# EAGLE design usblcd (EAGLE 6.6.0)
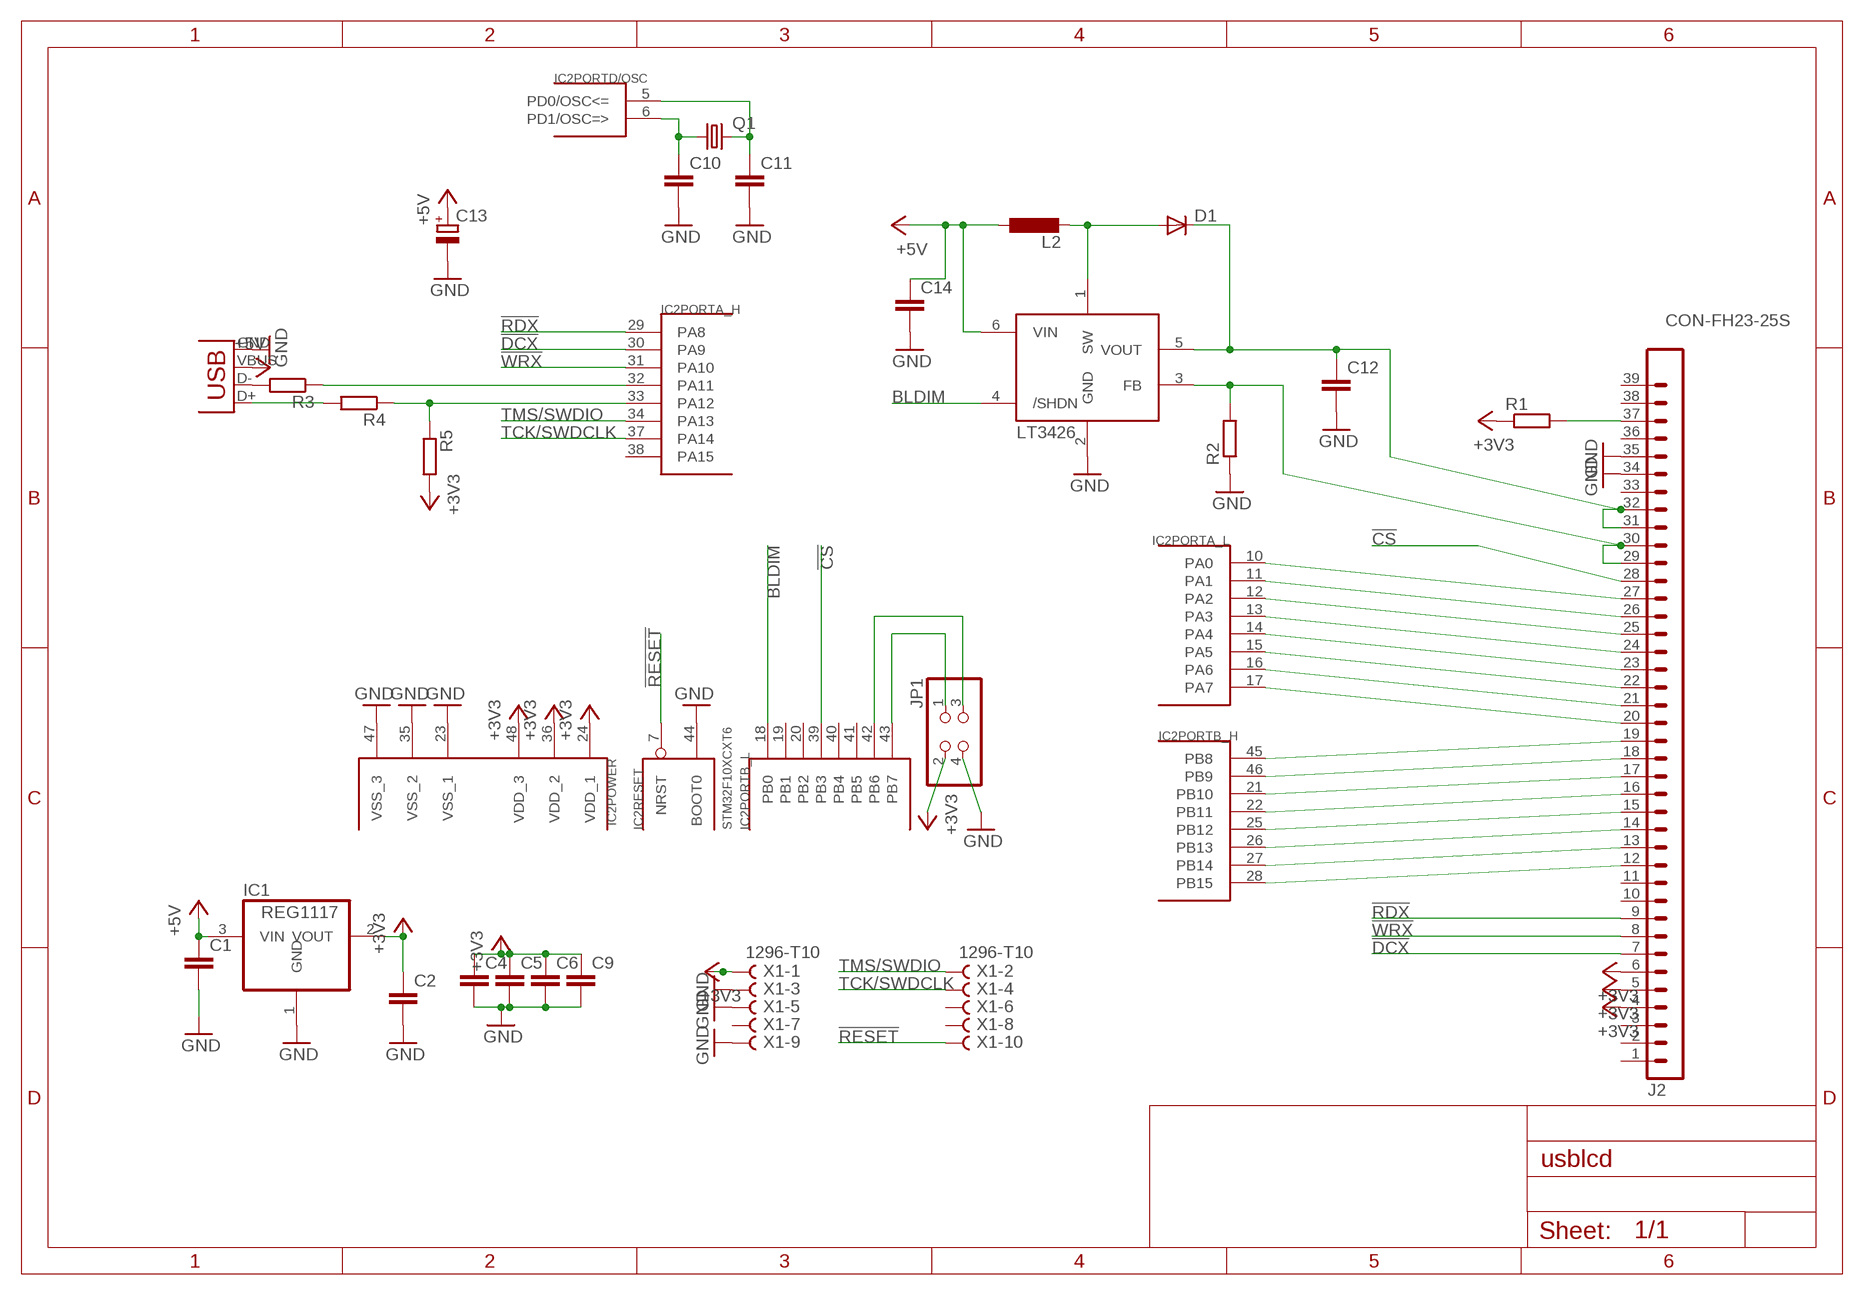
[diagram p0: schematic, sheet 1]

## Parts
C1  C-EUC0603  [C0603]
C2  C-EUC0603  [C0603]
C4  C-EUC0603  [C0603]
C5  C-EUC0805  [C0805]
C6  C-EUC0603  [C0603]
C9  C-EUC0603  [C0603]
C10  C-EUC0603  [C0603]
C11  C-EUC0603  [C0603]
C12  C-EUC0805  [C0805]
C13  CPOL-EUC  [PANASONIC_C]
C14  C-EUC0603  [C0603]
D1  DIODE-SOD323-W  [SOD323-W]
IC1  REG1117  [SOT223]
IC2  STM32F10XCXT6  [TQFP48]
J2  CON-FH23-25S  [FH23-25S]
JP1  PINHD-2X2_2.54-SMD  [2X02SMD]
L2  L-EUL3230M  [L3230M]
Q1  CRYSTALCTS406  [CTS406]
R1  R-EU_R0603  [R0603]
R2  R-EU_R0603  [R0603]
R3  R-EU_R0603  [R0603]
R4  R-EU_R0603  [R0603]
R5  R-EU_R0603  [R0603]
U$4  LT3426  [SOT23-6]
X1  1296-T10  [1296-10]
X2  USB-MICROB  [USB-MICROB]

## Nets
!CS: IC2.39(PORTB_L:PB3) J2.28
!DCX: IC2.30(PORTA_H:PA9) J2.7
!RDX: IC2.29(PORTA_H:PA8) J2.9
!RESET: IC2.7(RESET:NRST) X1.10
!WRX: IC2.31(PORTA_H:PA10) J2.8
+3V3: C2.1 C4.1 C5.1 C6.1 C9.1 IC1.2(VOUT) IC2.24(POWER:VDD_1) IC2.36(POWER:VDD_2) IC2.48(POWER:VDD_3) J2.4 J2.5 J2.6 JP1.2 R1.1 R5.2 X1.1
+5V: C1.1 C13.+ C14.1 IC1.3(VIN) L2.1 U$4.6(VIN) X2.VBUS
BLDIM: IC2.18(PORTB_L:PB0) U$4.4(/SHDN)
GND: C1.2 C2.2 C4.2 C5.2 C6.2 C9.2 C10.2 C11.2 C12.2 C13.- C14.2 IC1.1(GND) IC2.23(POWER:VSS_1) IC2.35(POWER:VSS_2) IC2.44(RESET:BOOT0) IC2.47(POWER:VSS_3) J2.34 J2.35 JP1.4 R2.1 U$4.2(GND) X1.3 X1.5 X1.9 X2.GND
N$1: IC2.16(PORTA_L:PA6) J2.21
N$2: IC2.15(PORTA_L:PA5) J2.22
N$3: IC2.14(PORTA_L:PA4) J2.23
N$4: IC2.13(PORTA_L:PA3) J2.24
N$5: IC2.12(PORTA_L:PA2) J2.25
N$6: IC2.11(PORTA_L:PA1) J2.26
N$7: IC2.10(PORTA_L:PA0) J2.27
N$8: IC2.32(PORTA_H:PA11) R3.1
N$9: IC2.27(PORTB_H:PB14) J2.13
N$10: IC2.26(PORTB_H:PB13) J2.14
N$11: IC2.25(PORTB_H:PB12) J2.15
N$12: IC2.22(PORTB_H:PB11) J2.16
N$13: IC2.21(PORTB_H:PB10) J2.17
N$14: IC2.46(PORTB_H:PB9) J2.18
N$15: IC2.45(PORTB_H:PB8) J2.19
N$16: IC2.17(PORTA_L:PA7) J2.20
N$17: IC2.28(PORTB_H:PB15) J2.12
N$18: C10.1 IC2.6(PORTD/OSC:PD1/OSC=>) Q1.1
N$19: C11.1 IC2.5(PORTD/OSC:PD0/OSC<=) Q1.3
N$21: R3.2 X2.D-
N$22: R4.2 X2.D+
N$23: IC2.33(PORTA_H:PA12) R4.1 R5.1
N$31: D1.A L2.2 U$4.1(SW)
N$32: C12.1 D1.C J2.31 J2.32 U$4.5(VOUT)
N$33: J2.29 J2.30 R2.2 U$4.3(FB)
N$41: J2.37 R1.2
SCL: IC2.42(PORTB_L:PB6) JP1.3
SDA: IC2.43(PORTB_L:PB7) JP1.1
TCK/SWDCLK: IC2.37(PORTA_H:PA14) X1.4
TMS/SWDIO: IC2.34(PORTA_H:PA13) X1.2
Unconnected: IC2.2(PORTC:PC13) IC2.3(PORTC:PC14) IC2.4(PORTC:PC15) IC2.19(PORTB_L:PB1) IC2.20(PORTB_L:PB2) IC2.38(PORTA_H:PA15) IC2.40(PORTB_L:PB4) IC2.41(PORTB_L:PB5) J2.1 J2.2 J2.3 J2.10 J2.11 J2.33 J2.36 J2.38 J2.39 X1.6 X1.7 X1.8

## Power pins joined to a net without a drawn wire
VBAT: IC2.1(AN_POWER:VBAT)
VDDA: IC2.9(AN_POWER:VDDA)
VSSA: IC2.8(AN_POWER:VSSA)

## Library data of the parts
C1 C2 C4-C6 C9-C12 C14 = rcl:C-EU: CAPACITOR, European symbol
C13 = rcl:CPOL-EU: POLARIZED CAPACITOR, European symbol
D1 = diode:DIODE-: DIODE
IC1 = burr-brown:REG1117: 800mA and 1A Low Dropout (LDO) Positive Regulator 1.8V, 2.5V, 2.85V, 3.3V, 5V, and Adj; MPN: REG1117; OC_FARNELL: 1097566; OC_NEWARK: 14P6981
IC2 = stm32:STM32F10XCXT6: ST STM32F101/103 48pin LQFP
J2 = dummylcd:CON-FH23-25S
JP1 = pinhead:PINHD-2X2: PIN HEADER
L2 = rcl:L-EU: INDUCTOR, European symbol
Q1 = crystal:CRYSTAL: CRYSTAL; OC_FARNELL: unknown; OC_NEWARK: unknown
R1-R5 = rcl:R-EU_: RESISTOR, European symbol
U$4 = adafruit:LT3426: LT3426 1.2MHz, 2A boost converter in SOT-23 http://www.linear.com/pc/productDetail.jsp?navId=H0,C1,C1003,C1042,C1031,C1061,P8430 (Linear website)
X1 = con-leotronics:1296-T10: 1.27mm SINGLE ROW FEMALE SOCKET Source: http://www.leotronics.co.uk/Conexcon/Data%20Sheets/sec.%20A/1296ing.pdf; OC_FARNELL: unknown; OC_NEWARK: unknown
X2 = _Sparkfun:USB: USB Connectors USB-B-PTH is fully proven SKU : PRT-00139 USB-miniB is fully proven SKU : PRT-00587 USB-A-PCB is untested. USB-A-H is throughly reviewed, but untested. Spark Fun Electronics SKU : PRT-00437 USB-B-SMT is throughly reviewed, but untested. Needs silkscreen touching up. USB-A-S has not been used/tested USB-MB-H has not been used/tested

## Board
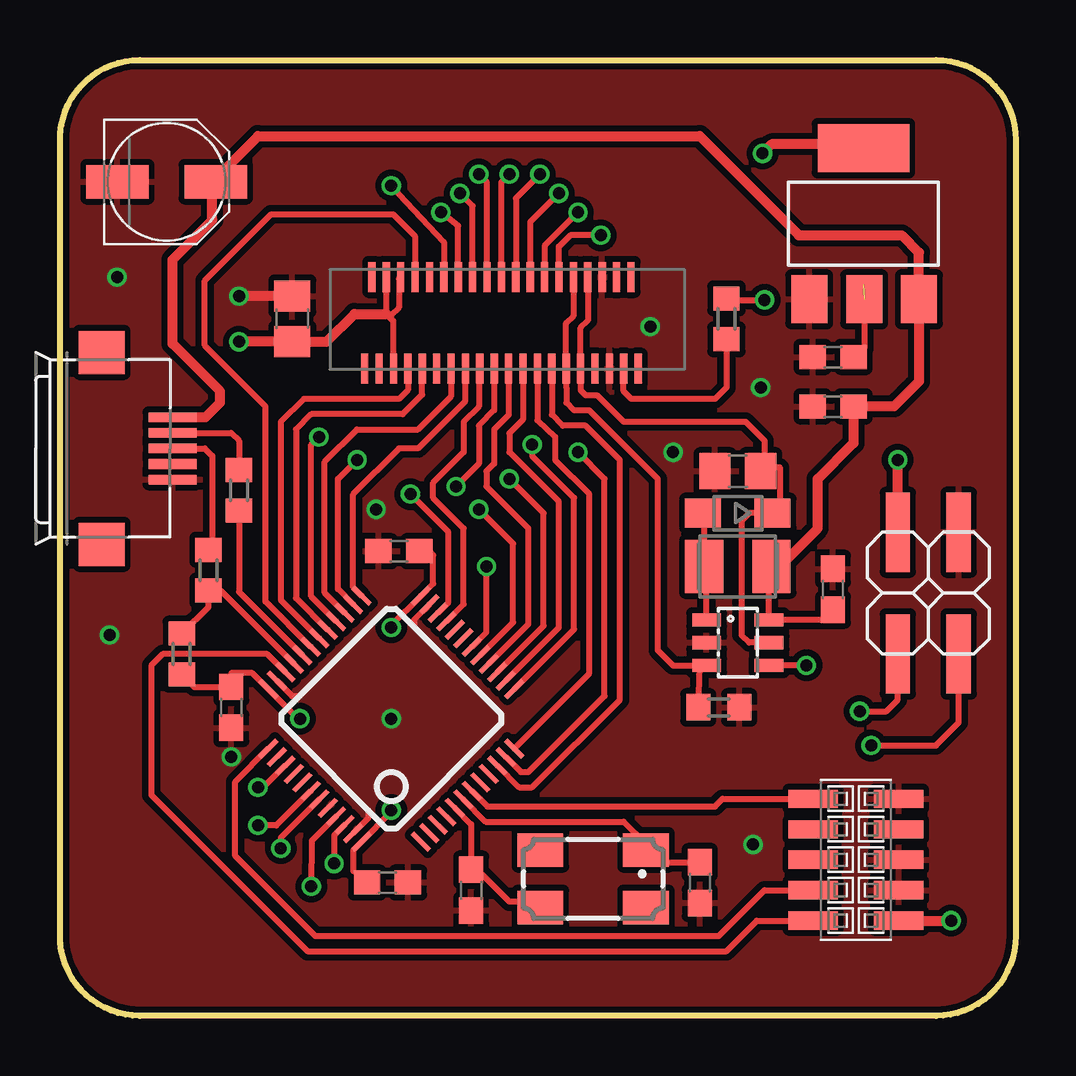
[diagram p1: board, top side]
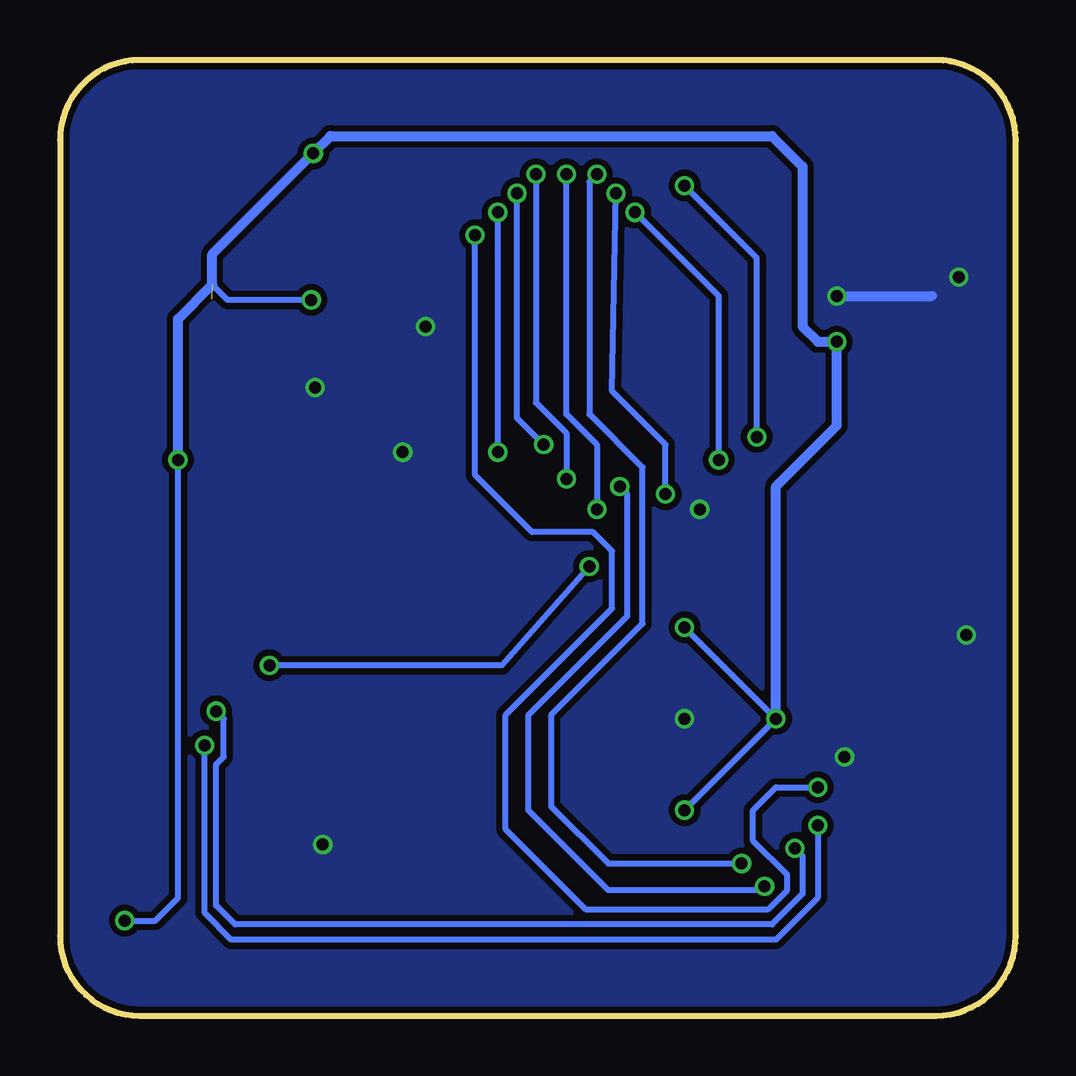
[diagram p2: board, bottom side, seen from below]

Size 39.85 x 39.85 mm. Coordinates in mm from the lower left corner, seen from the top.
Outline: 0,3.33 0,36.51 arc-90 3.33,39.85 36.51,39.85 arc-90 39.85,36.51 39.85,3.33 arc-90 36.51,0 3.33,0 arc-90 0,3.33
Copper layers (1*16): Top 0.035mm / dielectric 1.5mm / Bottom 0.035mm
Design rules "dirt_cheap_dirty_boards.v1": minimum track width 5mil, minimum drill 12mil, track to track 5mil, track to pad 5mil, pad to pad 5mil, via to via 5mil, smd to smd 0mil, copper to edge 10mil, drill to drill 10mil, minimum pad ring 10mil, minimum via ring 6mil, stop-mask expansion 2mil, vias tented up to drill 25mil, thermal gap 10mil

### Footprints (pad centres in the part's own frame; a part is rotated, then mirrored left to right if it is on the bottom)
C0603 = smd 1.1 x 1: 1 -0.85,0; 2 0.85,0
C0805 = smd 1.3 x 1.5: 1 -0.95,0; 2 0.95,0
PANASONIC_C = smd 2.6 x 1.4: + 2.05,0; - -2.05,0
SOD323-W = smd 1.5 x 1.2: A 1.45,0; C -1.45,0
SOT223 = smd 1.499 x 2.007: 1 -2.261,-3.15; 2 0.025,-3.15; 3 2.311,-3.15 | smd 3.81 x 2.007: 4 0,3.15
TQFP48 = smd 0.2 x 1: 1 -2.75,-4.5; 2 -2.25,-4.5; 3 -1.75,-4.5; 4 -1.25,-4.5; 5 -0.75,-4.5; 6 -0.25,-4.5; 7 0.25,-4.5; 8 0.75,-4.5; 9 1.25,-4.5; 10 1.75,-4.5; 11 2.25,-4.5; 12 2.75,-4.5; 25 2.75,4.5; 26 2.25,4.5; 27 1.75,4.5; 28 1.25,4.5; 29 0.75,4.5; 30 0.25,4.5; 31 -0.25,4.5; 32 -0.75,4.5; 33 -1.25,4.5; 34 -1.75,4.5; 35 -2.25,4.5; 36 -2.75,4.5 | smd 1 x 0.2: 13 4.5,-2.75; 14 4.5,-2.25; 15 4.5,-1.75; 16 4.5,-1.25; 17 4.5,-0.75; 18 4.5,-0.25; 19 4.5,0.25; 20 4.5,0.75; 21 4.5,1.25; 22 4.5,1.75; 23 4.5,2.25; 24 4.5,2.75; 37 -4.5,2.75; 38 -4.5,2.25; 39 -4.5,1.75; 40 -4.5,1.25; 41 -4.5,0.75; 42 -4.5,0.25; 43 -4.5,-0.25; 44 -4.5,-0.75; 45 -4.5,-1.25; 46 -4.5,-1.75; 47 -4.5,-2.25; 48 -4.5,-2.75
FH23-25S = smd 0.3 x 1.25: 1 0,0.625; 2 0.3,4.45; 3 0.6,0.625; 4 0.9,4.45; 5 1.2,0.625; 6 1.5,4.45; 7 1.8,0.625; 8 2.1,4.45; 9 2.4,0.625; 10 2.7,4.45; 11 3,0.625; 12 3.3,4.45; 13 3.6,0.625; 14 3.9,4.45; 15 4.2,0.625; 16 4.5,4.45; 17 4.8,0.625; 18 5.1,4.45; 19 5.4,0.625; 20 5.7,4.45; 21 6,0.625; 22 6.3,4.45; 23 6.6,0.625; 24 6.9,4.45; 25 7.2,0.625; 26 7.5,4.45; 27 7.8,0.625; 28 8.1,4.45; 29 8.4,0.625; 30 8.7,4.45; 31 9,0.625; 32 9.3,4.45; 33 9.6,0.625; 34 9.9,4.45; 35 10.2,0.625; 36 10.5,4.45; 37 10.8,0.625; 38 11.1,4.45; 39 11.4,0.625
2X02SMD = smd 1.016 x 3.302: 1 -1.27,-3.81; 2 -1.27,1.27; 3 1.27,-3.81; 4 1.27,1.27
L3230M = smd 1.6 x 2.2: 1 -1.4,0; 2 1.4,0
CTS406 = smd 1.9 x 1.4: 1 -2.2,-1.2; 2 2.2,-1.2; 3 2.2,1.2; 4 -2.2,1.2
R0603 = smd 1 x 1.1: 1 -0.85,0; 2 0.85,0
SOT23-6 = smd 0.55 x 1.2: 1 -0.95,-1.3; 2 0,-1.3; 3 0.95,-1.3; 4 0.95,1.3; 5 0,1.3; 6 -0.95,1.3
1296-10 = smd 0.76 x 2.05: 1 -2.54,-1.78; 2 -2.54,1.78; 3 -1.27,-1.78; 4 -1.27,1.78; 5 0,-1.78; 6 0,1.78; 7 1.27,-1.78; 8 1.27,1.78; 9 2.54,-1.78; 10 2.54,1.78
USB-MICROB = smd 0.4 x 2: D+ 0,3.1; D- -0.65,3.1; GND 1.3,3.1; ID 0.65,3.1; VBUS -1.3,3.1 | smd 1.8 x 1.9: GND@2 -4,0.15; GND@3 4,0.15

### Placement (x,y rotation side)
C1  32.23,25.4 180 top
C2  32.23,27.46 180 top
C4  7.14,12.86 270 top
C5  9.68,29.05 90 top
C6  13.65,5.56 0 top
C9  14.13,19.37 180 top
C10  26.67,5.56 270 top
C11  17.14,5.24 270 top
C12  28.26,22.7 180 top
C13  4.45,34.77 0 top
C14  32.23,17.78 90 top
D1  28.26,20.95 180 top
IC1  33.5,33.02 0 top
IC2  13.81,12.38 45 top
J2  12.7,26.35 0 top
JP1  36.2,18.89 0 top
L2  28.26,18.73 180 top
Q1  22.23,5.71 180 top
R1  27.78,29.05 270 top
R2  27.46,12.86 180 top
R3  7.46,21.91 90 top
R4  6.19,18.57 90 top
R5  5.08,15.08 270 top
U$4  28.26,15.56 270 top
X1  33.18,6.51 90 top
X2  1.59,23.65 270 top

### Tracks (layer width: path | path; a pad name or v marks a point on that pad's centre or on a via)
!CS  (via drill 0.5)
  Top 0.254: J2.28 20.8,32.07 21.27,32.54 v22.54,32.54 | IC2.39 8.48,9.53 v8.26,9.53
  Bottom 0.254: v22.54,32.54 22.54,22.54 20.16,20.16 17.62,20.16 16.83,19.37 16.83,16.99 21.27,12.54 21.27,7.78 17.94,4.45 10.32,4.45 9.53,5.24 9.53,5.87 10.95,7.3 10.95,8.57 10,9.53 v8.26,9.53
!DCX
  Top 0.254: J2.7 14.5,26.09 14.13,25.72 10.16,25.72 9.21,24.77 9.21,17.34 IC2.30
!RDX
  Top 0.254: J2.9 15.1,25.89 14.29,25.08 10.48,25.08 9.84,24.45 9.84,17.41 IC2.29
!RESET
  Top 0.254: IC2.7 17.82,8.73 27.3,8.73 27.62,9.05 X1.10
!WRX
  Top 0.254: J2.8 14.8,32.51 13.89,33.42 8.81,33.42 6.03,30.64 6.03,27.94 8.57,25.4 8.57,17.27 IC2.31
+3V3  (via drill 0.5)  (1 unrouted)
  Top 0.254: 33.52,36.33 33.5,36.35 | IC1.2 33.52,27.81 C2.1 | J2.4 13.6,29.26 13.81,29.05 | 13.81,29.05 13.9,28.96 J2.5 | J2.6 14.13,30.73 14.13,29.53 13.81,29.21 13.81,29.05 | v10,12.38 9.92,12.38 IC2.36 8.02,14.29 7.14,14.29 C4.1 5.6,13.71 R5.2 | v13.81,16.19 13.81,16.27 IC2.24 15.56,18.02 15.56,19.21 15.4,19.37 C9.1 | v13.81,8.57 13.81,8.49 IC2.48 12.22,6.91 12.22,6.03 12.8,5.71 C6.1 | R1.1 27.84,29.84 v29.37,29.84
  Top 0.406: 13.6,29.26 12.28,29.26 11.11,28.1 C5.1 v7.46,28.1 | X1.1 v37.15,3.97 | 33.52,36.33 29.66,36.33 v29.29,35.96 | JP1.2 v34.92,23.18
  Bottom 0.254: v13.81,8.57 v10,12.38 v13.81,16.19 | v37.15,3.97 35.88,3.97 34.92,4.92 v34.92,23.18 | v29.37,29.84 32.86,29.84 33.5,30.48
  Bottom 0.406: v10,12.38 10,22.07 7.46,24.61 v7.46,28.1 8.26,28.1 8.89,28.73 8.89,35.4 10.16,36.67 28.57,36.67 v29.29,35.96 33.5,31.75 33.5,30.48 34.92,29.05 v34.92,23.18
+5V
  Top 0.254: L2.1 29.56,18.63 U$4.6 31.8,16.51 C14.1 | 6.51,34.92 6.5,34.91 C13.+
  Top 0.406: X2.VBUS 6.06,24.95 6.67,25.56 6.67,26.04 4.69,28.02 4.69,31.52 6.35,33.18 6.35,34.62 C13.+ | 6.51,34.92 8.26,36.67 26.67,36.67 30.8,32.54 35.08,32.54 35.81,31.82 IC1.3 35.81,26.44 34.77,25.4 C1.1 33.08,23.87 31.59,22.38 31.59,20.32 30,18.73 L2.1
BLDIM  (via drill 0.5)
  Top 0.254: IC2.18 17.78,16 v17.78,18.73 | v31.11,14.61 U$4.4
  Bottom 0.254: v17.78,18.73 21.43,14.61 v31.11,14.61
GND  (via drill 0.5)
  Top 0.254: IC2.35 9.68,13.34 10,13.34 | IC2.47 12.86,8.25 12.86,8.57 | IC2.23 14.76,16.52 14.76,16.19
  Top 0.406: C5.2 v7.46,30
  Bottom 0.406: v7.46,30 3.49,30
  other vias: 13.81,12.38 7.14,10.79 2.06,15.88 24.61,28.73 25.56,23.5 28.89,7.14 13.18,21.11 2.38,30.8 29.21,26.19
  pour Top (isolate 0.254): -26.67,54.61 -6.19,-66.83 84.77,-66.83 64.29,54.61
  pour Bottom (isolate 0.254): -23.34,54.93 70.17,54.93 85.41,-65.88 -8.1,-65.88
N$1
  Top 0.254: J2.21 18.7,25.05 18.1,24.45 18.1,23.02 17.78,22.7 17.78,22.07 19.53,20.32 19.53,16.33 IC2.16
N$2  (via drill 0.5)
  Top 0.254: v20,35.08 19,34.08 J2.22 | 19.05,22.07 v18.73,22.38 20.16,20.95 20.16,16.26 IC2.15
  Bottom 0.254: v20,35.08 20,25.56 18.73,24.29 v18.73,22.38
N$3
  Top 0.254: J2.23 19.3,24.86 18.73,24.29 18.73,23.5 20.8,21.43 20.8,16.19 IC2.14
N$4  (via drill 0.5)
  Top 0.254: v20.8,34.29 19.6,33.09 J2.24 | v19.68,23.81 19.68,23.34 21.43,21.59 21.43,16.11 IC2.13
  Bottom 0.254: v19.68,23.81 20.8,24.92 v20.8,34.29
N$5
  Top 0.254: J2.25 19.9,24.82 20.64,24.13 20.64,23.18 22.07,21.75 22.07,14.27 IC2.12
N$6  (via drill 0.5)
  Top 0.254: v21.59,33.5 20.2,32.11 J2.26 | IC2.11 19.22,10.16 19.53,10.16 22.7,13.34 22.7,22.38 v21.59,23.5
  Bottom 0.254: v21.59,23.5 v21.59,33.5
N$7
  Top 0.254: J2.27 20.5,25.06 20.95,24.61 21.91,24.61 23.34,23.18 23.34,13.18 19.68,9.53 19.14,9.53 IC2.10
N$8
  Top 0.254: R3.1 7.46,17.67 IC2.32
N$9
  Top 0.254: J2.13 16.3,25.82 14.92,24.45 12.38,24.45 11.03,23.1 11.03,17.64 IC2.27
N$10  (via drill 0.5)
  Top 0.254: J2.14 16.6,32.93 v15.88,33.5 | IC2.26 11.59,17.79 11.59,22.38 v12.38,23.18
  Bottom 0.254: v12.38,23.18 12.38,30 v15.88,33.5
N$11
  Top 0.254: J2.15 16.9,25.63 14.92,23.65 14.13,23.65 12.22,21.75 12.22,17.86 IC2.25
N$12  (via drill 0.5)
  Top 0.254: J2.16 17.2,33.76 v16.67,34.29 | IC2.22 16.19,17.24 16.19,20.16 v14.61,21.75
  Bottom 0.254: v14.61,21.75 14.61,23.81 16.83,26.04 v16.67,34.29
N$13
  Top 0.254: J2.17 17.46,26.94 17.46,25.4 16.83,24.77 16.83,23.5 15.56,22.23 15.56,21.59 16.83,20.32 16.83,17.17 IC2.21
N$14  (via drill 0.5)
  Top 0.254: J2.18 17.8,34.75 v17.46,35.08 | IC2.46 11.43,7.53 v11.43,6.35
  Bottom 0.254: v17.46,35.08 17.78,34.77 17.78,25.08 15.56,22.86 15.56,16.35 19.37,12.54 19.37,8.73 16.99,6.35 v11.43,6.35
N$15  (via drill 0.5)
  Top 0.254: J2.19 18.1,25.24 17.46,24.61 17.46,23.02 v16.51,22.07 | IC2.45 10.5,7.3 v10.48,5.4
  Bottom 0.254: v10.48,5.4 10.48,5.24 16.99,5.24 20.32,8.57 20.32,12.54 16.19,16.67 16.19,21.75 v16.51,22.07
N$16  (via drill 0.5)
  Top 0.254: J2.20 18.4,34.75 v18.73,35.08 | IC2.17 18.89,16.4 18.89,19.68 v17.46,21.11
  Bottom 0.254: v18.73,35.08 18.73,25.08 17.46,23.81 v17.46,21.11
N$17  (via drill 0.5)
  Top 0.254: v13.81,34.61 16,32.26 J2.12 | IC2.28 10.48,17.48 10.48,23.81 v10.79,24.13
  Bottom 0.254: v10.79,24.13 10.79,31.59 v13.81,34.61
N$18
  Top 0.254: IC2.6 17.74,8.1 23.5,8.1 24.43,7.17 Q1.1 24.93,6.41 C10.1
N$19
  Top 0.254: IC2.5 17.14,7.99 C11.1 17.41,6.09 18.73,4.76 19.78,4.76 Q1.3
N$20  (via drill 0.5)
  other vias: 9.21,6.99
N$21
  Top 0.254: X2.D- 7.13,24.3 7.46,23.97 R3.2
N$22
  Top 0.254: X2.D+ 6.03,23.65 6.35,23.34 6.35,19.74 R4.2
N$23
  Top 0.254: IC2.33 6.7,17.72 R4.1 6.19,17.04 R5.1
N$31
  Top 0.254: U$4.1 26.96,18.63 L2.2 26.86,20.91 D1.A
N$32
  Top 0.254: J2.32 22,28.98 21.7,28.68 J2.31 21.7,26.08 21.91,25.88 22.38,25.88 23.5,24.77 28.57,24.77 29.37,23.97 29.37,23.18 arc90 29.69,22.86 | U$4.5 28.73,15.56 28.42,15.88 28.42,20.64 28.73,20.95 D1.C 30,21.25 30,22.86 29.69,22.86 | 29.69,22.86 29.37,22.86 C12.1 29.05,22.55 29.05,22.23 29.37,22.54
N$33
  Top 0.254: J2.30 21.4,29.18 21.1,28.88 J2.29 21.1,26.21 21.11,26.19 21.11,25.56 21.43,25.24 22.07,25.24 24.92,22.38 24.92,15.24 25.56,14.61 U$4.3 26.67,14.57 R2.2
N$41
  Top 0.254: R1.2 27.78,26.19 27.3,25.72 23.81,25.72 23.5,26.04 J2.37
SCL  (via drill 0.5)
  Top 0.254: IC2.42 9.01,7.94 v8.26,7.94 | v33.81,11.27 36.51,11.27 37.47,12.22 JP1.3
  Bottom 0.254: v8.26,7.94 8.26,4.92 10,3.17 32.7,3.17 33.81,4.29 v33.81,11.27
SDA  (via drill 0.5)  (1 unrouted)
  Top 0.254: IC2.43 9.21,7.42 9.21,6.99 | v33.34,12.7 34.45,12.7 34.92,13.18 34.92,14.29
  Top 0.61: 34.92,14.29 JP1.1
  Bottom 0.254: 9.21,6.99 8.89,6.67 8.89,5.08 10.16,3.81 32.54,3.81 33.34,4.6 33.34,10.48 33.02,10.79 33.02,12.38 v33.34,12.7
TCK/SWDCLK
  Top 0.254: IC2.37 7.3,9.76 7.3,6.67 10.64,3.33 27.46,3.33 29.37,5.24 X1.4
TMS/SWDIO
  Top 0.254: IC2.34 8.64,15.08 4.29,15.08 3.81,14.61 3.81,9.21 10.32,2.7 27.78,2.7 29.05,3.97 X1.2